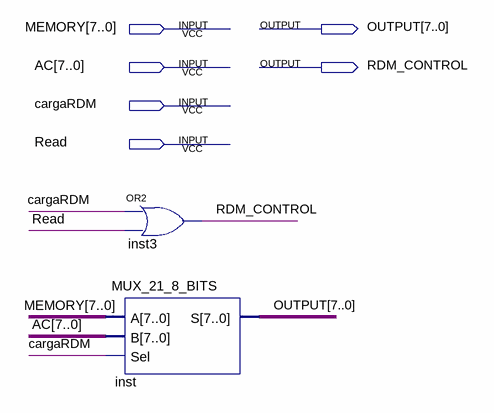
[diagram p0: schematic sheet]
// Quartus schematic RDM_SELECTOR.bdf as structural Verilog: 2 symbols, 6 pins
module RDM_SELECTOR (
  input  [7:0] MEMORY,
  input  [7:0] AC,
  input  cargaRDM,
  input  Read,
  output [7:0] OUTPUT,
  output RDM_CONTROL
);

  or inst3 (RDM_CONTROL, cargaRDM, Read);
  MUX_21_8_BITS inst (.A(MEMORY), .B(AC), .Sel(cargaRDM), .S(OUTPUT));
endmodule
